# EAGLE design motoko_azure_dragon (EAGLE 9.6.0)
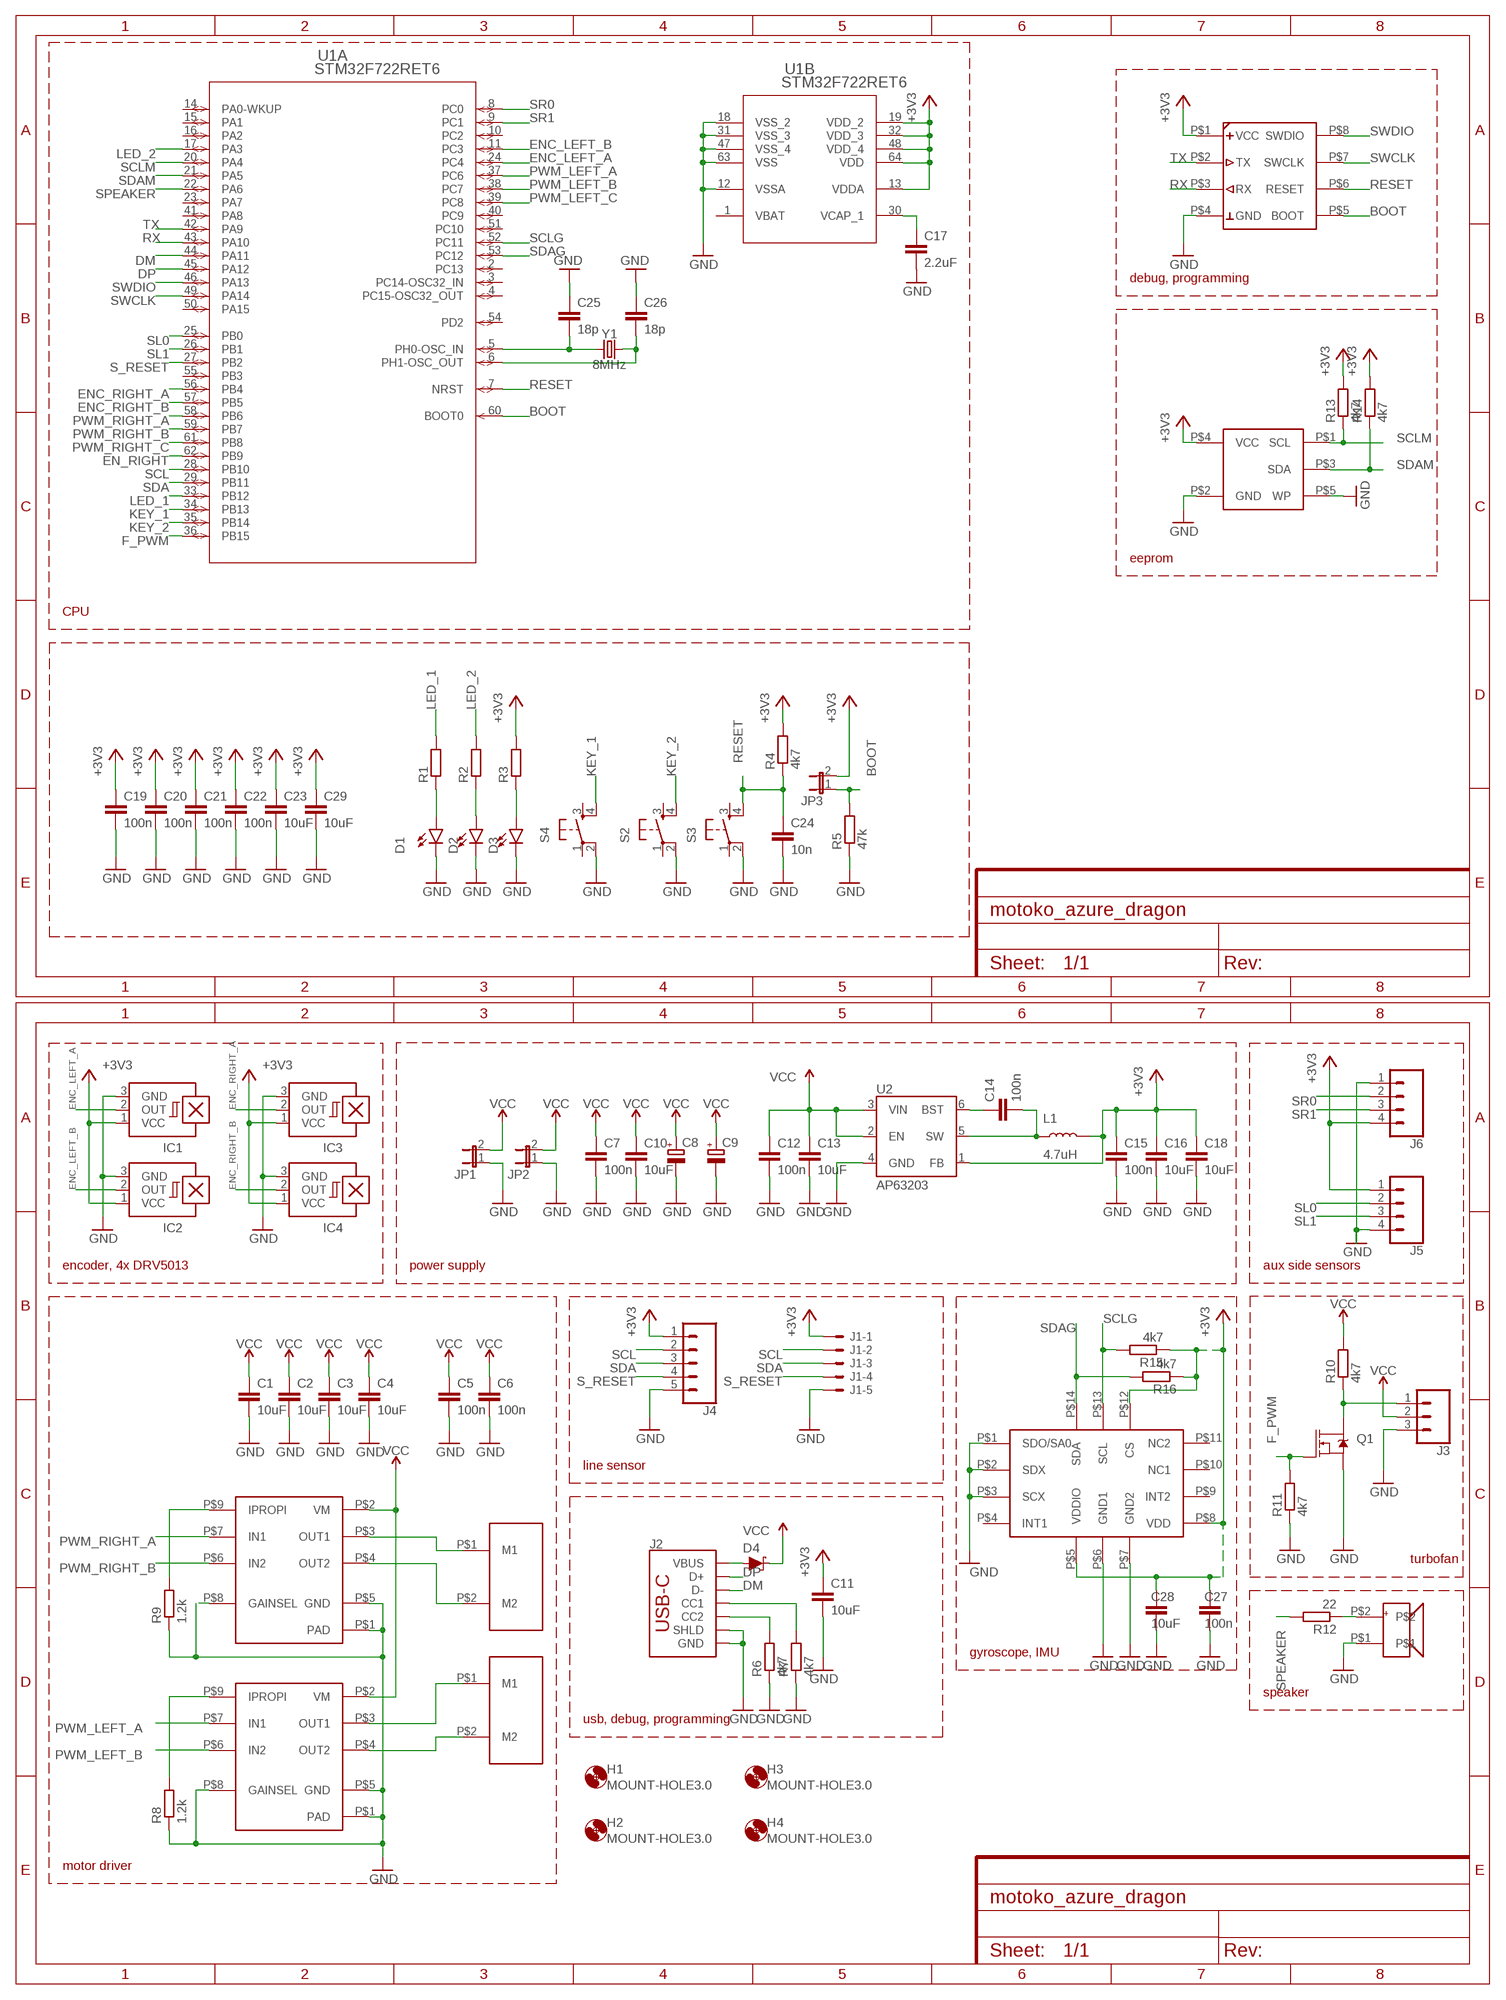
[diagram p0: schematic, sheet 1]

## Parts
C1  10uF  C-EUC0805  [C0805]
C2  10uF  C-EUC0805  [C0805]
C3  10uF  C-EUC0805  [C0805]
C4  10uF  C-EUC0805  [C0805]
C5  100n  C-EUC0805  [C0805]
C6  100n  C-EUC0805  [C0805]
C7  100n  C-EUC0805  [C0805]
C8  CPOL-EUB/3528-21W  [B/3528-21W]
C9  CPOL-EUB/3528-21W  [B/3528-21W]
C10  10uF  C-EUC0805  [C0805]
C11  10uF  C-EUC0805  [C0805]
C12  100n  C-EUC0805  [C0805]
C13  10uF  C-EUC0805  [C0805]
C14  100n  C-EUC0805  [C0805]
C15  100n  C-EUC0805  [C0805]
C16  10uF  C-EUC0805  [C0805]
C17  2.2uF  C-EUC0805  [C0805]
C18  10uF  C-EUC0805  [C0805]
C19  100n  C-EUC0805  [C0805]
C20  100n  C-EUC0805  [C0805]
C21  100n  C-EUC0805  [C0805]
C22  100n  C-EUC0805  [C0805]
C23  10uF  C-EUC0805  [C0805]
C24  10n  C-EUC0805  [C0805]
C25  18p  C-EUC0805  [C0805]
C26  18p  C-EUC0805  [C0805]
C27  100n  C-EUC0805  [C0805]
C28  10uF  C-EUC0805  [C0805]
C29  10uF  C-EUC0805  [C0805]
D1  LED1206  [LED-1206]
D2  LED1206  [LED-1206]
D3  LED1206  [LED-1206]
D4  3A/10V/280mV  DIODE-SCHOTTKY-BAT60A  [SOD-323]
H1  MOUNT-HOLE3.0  [3,0]
H2  MOUNT-HOLE3.0  [3,0]
H3  MOUNT-HOLE3.0  [3,0]
H4  MOUNT-HOLE3.0  [3,0]
IC1  A1202LH  [SOT23-W]
IC2  A1202LH  [SOT23-W]
IC3  A1202LH  [SOT23-W]
IC4  A1202LH  [SOT23-W]
J1  XF2L-0535-1  [XF2L-0535-1]
J2  USB_C_2-LAYER_PADS  [USB-C-16P-2LAYER-PADS]
J3  CONN_03LONGPADS  [1X03_LONGPADS]
J4  CONN_051.27MM  [1X05_1.27MM]
J5  1X04_SMD_STRAIGHT_COMBO  CONN_04SMD_STRAIGHT_COMBO  [1X04_SMD_VERTICAL_COMBO]
J6  1X04_SMD_STRAIGHT_COMBO  CONN_04SMD_STRAIGHT_COMBO  [1X04_SMD_VERTICAL_COMBO]
JP1  JP1E  [JP1]
JP2  JP1E  [JP1]
JP3  JP1E  [JP1]
L1  4.7uH  INDUCTOR-CR54-3.3UH  [CR54]
Q1  5.8A/30V/35mΩ  MOSFET-NCH-AO3404A  [SOT23-3]
R1  R-EU_M0805  [M0805]
R2  R-EU_M0805  [M0805]
R3  R-EU_M0805  [M0805]
R4  4k7  R-EU_M0805  [M0805]
R5  47k  R-EU_M0805  [M0805]
R6  4k7  R-EU_M0805  [M0805]
R7  4k7  R-EU_M0805  [M0805]
R8  1.2k  R-EU_M0805  [M0805]
R9  1.2k  R-EU_M0805  [M0805]
R10  4k7  R-EU_M0805  [M0805]
R11  4k7  R-EU_M0805  [M0805]
R12  22  R-EU_M0805  [M0805]
R13  4k7  R-EU_M0805  [M0805]
R14  4k7  R-EU_M0805  [M0805]
R15  4k7  R-EU_M0805  [M0805]
R16  4k7  R-EU_M0805  [M0805]
S2  TAC_SWITCHSMD  [TACTILE-SWITCH-SMD]
S3  TAC_SWITCHSMD  [TACTILE-SWITCH-SMD]
S4  TAC_SWITCHSMD  [TACTILE-SWITCH-SMD]
U1  STM32F722RET6  [LQFP64-10X10MM]
U2  AP63203  [SOT23-6]
U$2  POLOLU_MICRO_METAL_GEAR_MOTOR  [POLOLU_MICRO_METAL_GEAR_MOTOR]
U$3  POLOLU_MICRO_METAL_GEAR_MOTOR  [POLOLU_MICRO_METAL_GEAR_MOTOR]
U$4  DRV8213  [DSG8]
U$5  DRV8213  [DSG8]
U$6  24LC24_SOT23  [SOT23]
U$7  DEBUG_CON  [HEADER_4X2_1.27]
U$8  LSM6DSM  [LGA14L]
U$9  SPEAKER_SMD_SMT0440  [SPEAKER_SMD_SMT0440]
Y1  8MHz  CRYSTALSMD-3.2X2.5  [CRYSTAL-SMD-3.2X2.5MM]

## Nets
+3V3: C11.1 C15.1 C16.1 C18.1 C19.1 C20.1 C21.1 C22.1 C23.1 C27.1 C28.1 C29.1 IC1.1(VCC) IC2.1(VCC) IC3.1(VCC) IC4.1(VCC) J1.1 J4.1 J5.1 J6.4 JP3.2 L1.P$2 R3.2 R4.2 R13.2 R14.2 R15.1 R16.1 U1.13(B:VDDA) U1.19(B:VDD_2) U1.32(B:VDD_3) U1.48(B:VDD_4) U1.64(B:VDD) U2.1(FB) U$6.P$4(VCC) U$7.P$1(VCC) U$8.P$5(VDDIO) U$8.P$8(VDD) U$8.P$12(CS)
BOOT: JP3.1 R5.2 U1.60(A:BOOT0) U$7.P$5(BOOT)
DM: J2.A7(D-) J2.B7(D-) U1.44(A:PA11)
DP: J2.A6(D+) J2.B6(D+) U1.45(A:PA12)
EN_RIGHT: U1.62(A:PB9)
ENC_LEFT_A: IC1.2(OUT) U1.24(A:PC4)
ENC_LEFT_B: IC2.2(OUT) U1.11(A:PC3)
ENC_RIGHT_A: IC3.2(OUT) U1.56(A:PB4)
ENC_RIGHT_B: IC4.2(OUT) U1.57(A:PB5)
F_PWM: Q1.1(G) R11.2 U1.36(A:PB15)
GND: C1.2 C2.2 C3.2 C4.2 C5.2 C6.2 C7.2 C8.- C9.- C10.2 C11.2 C12.2 C13.2 C15.2 C16.2 C17.2 C18.2 C19.2 C20.2 C21.2 C22.2 C23.2 C24.2 C25.1 C26.1 C27.2 C28.2 C29.2 D1.C D2.C D3.C IC1.3(GND) IC2.3(GND) IC3.3(GND) IC4.3(GND) J1.5 J2.GND J2.GND2(GND) J2.SHLD1(SHLD) J2.SHLD2(SHLD) J2.SHLD3(SHLD) J2.SHLD4(SHLD) J3.3 J4.5 J5.4 J6.1 JP1.1 JP2.1 Q1.2(S) R5.1 R6.1 R7.1 R8.1 R9.1 R11.1 S2.2 S3.2 S4.2 U1.12(B:VSSA) U1.18(B:VSS_2) U1.31(B:VSS_3) U1.47(B:VSS_4) U1.63(B:VSS) U2.4(GND) U$4.P$1(PAD) U$4.P$5(GND) U$4.P$8(GAINSEL) U$5.P$1(PAD) U$5.P$5(GND) U$5.P$8(GAINSEL) U$6.P$2(GND) U$6.P$5(WP) U$7.P$4(GND) U$8.P$1(SDO/SA0) U$8.P$2(SDX) U$8.P$3(SCX) U$8.P$6(GND1) U$8.P$7(GND2) U$9.P$1
KEY_1: S4.4 U1.34(A:PB13)
KEY_2: S2.4 U1.35(A:PB14)
LED_1: R1.2 U1.33(A:PB12)
LED_2: R2.2 U1.17(A:PA3)
N$1: U$3.P$2(M2) U$5.P$4(OUT2)
N$2: U$3.P$1(M1) U$5.P$3(OUT1)
N$3: U$2.P$2(M2) U$4.P$4(OUT2)
N$4: U$2.P$1(M1) U$4.P$3(OUT1)
N$5: C14.2 L1.P$1 U2.5(SW)
N$6: C14.1 U2.6(BST)
N$7: D1.A R1.1
N$8: D2.A R2.1
N$9: D3.A R3.1
N$10: J2.B5(CC2) R6.2
N$11: J2.A5(CC1) R7.2
N$12: C17.1 U1.30(B:VCAP_1)
N$13: C25.2 U1.5(A:PH0-OSC_IN) Y1.1
N$14: C26.2 U1.6(A:PH1-OSC_OUT) Y1.3
N$15: R8.2 U$5.P$9(IPROPI)
N$16: R9.2 U$4.P$9(IPROPI)
N$17: D4.A J2.VBUS1(VBUS) J2.VBUS2(VBUS)
N$18: J3.1 Q1.3(D) R10.1
N$19: R12.1 U$9.P$2
PWM_LEFT_A: U1.37(A:PC6) U$5.P$7(IN1)
PWM_LEFT_B: U1.38(A:PC7) U$5.P$6(IN2)
PWM_LEFT_C: U1.39(A:PC8)
PWM_RIGHT_A: U1.58(A:PB6) U$4.P$7(IN1)
PWM_RIGHT_B: U1.59(A:PB7) U$4.P$6(IN2)
PWM_RIGHT_C: U1.61(A:PB8)
RESET: C24.1 R4.1 S3.4 U1.7(A:NRST) U$7.P$6(RESET)
RX: U1.43(A:PA10) U$7.P$3(RX)
S_RESET: J1.4 J4.4 U1.27(A:PB2)
SCL: J1.2 J4.2 U1.28(A:PB10)
SCLG: R15.2 U1.52(A:PC11) U$8.P$13(SCL)
SCLM: R13.1 U1.20(A:PA4) U$6.P$1(SCL)
SDA: J1.3 J4.3 U1.29(A:PB11)
SDAG: R16.2 U1.53(A:PC12) U$8.P$14(SDA)
SDAM: R14.1 U1.21(A:PA5) U$6.P$3(SDA)
SL0: J5.2 U1.25(A:PB0)
SL1: J5.3 U1.26(A:PB1)
SPEAKER: R12.2 U1.22(A:PA6)
SR0: J6.2 U1.8(A:PC0)
SR1: J6.3 U1.9(A:PC1)
SWCLK: U1.49(A:PA14) U$7.P$7(SWCLK)
SWDIO: U1.46(A:PA13) U$7.P$8(SWDIO)
TX: U1.42(A:PA9) U$7.P$2(TX)
VCC: C1.1 C2.1 C3.1 C4.1 C5.1 C6.1 C7.1 C8.+ C9.+ C10.1 C12.1 C13.1 D4.C J3.2 JP1.2 JP2.2 R10.2 U2.2(EN) U2.3(VIN) U$4.P$2(VM) U$5.P$2(VM)
Unconnected: S2.1 S2.3 S3.1 S3.3 S4.1 S4.3 U1.2(A:PC13) U1.3(A:PC14-OSC32_IN) U1.4(A:PC15-OSC32_OUT) U1.10(A:PC2) U1.14(A:PA0-WKUP) U1.15(A:PA1) U1.16(A:PA2) U1.23(A:PA7) U1.40(A:PC9) U1.41(A:PA8) U1.50(A:PA15) U1.51(A:PC10) U1.54(A:PD2) U1.55(A:PB3) U$8.P$4(INT1) U$8.P$9(INT2) U$8.P$10(NC1) U$8.P$11(NC2)

## Notes on the sheet
- debug, programming
- eeprom
- CPU
- encoder, 4x DRV5013 | power supply | aux side sensors
- line sensor
- turbofan
- gyroscope, IMU
- speaker
- usb, debug, programming
- motor driver

## Power pins joined to a net without a drawn wire
VBAT: U1.1(B:VBAT)

## Library data of the parts
C1-C7 C10-C29 = rcl:C-EU: CAPACITOR, European symbol; SPICEPREFIX: C
C8 C9 = rcl:CPOL-EU: POLARIZED CAPACITOR, European symbol; SPICEPREFIX: C
D1-D3 = SparkFun-LED:LED: LED (Generic) Standard schematic elements and footprints for 5mm, 3mm, 1206, and 0603 sized LEDs. Generic LEDs with no color specified.
D4 = SparkFun-DiscreteSemi:DIODE-SCHOTTKY: Schottky diode A Schottky diode is a semiconductor diode which has a low forward voltage drop and a very fast switching action.; PROD_ID: DIO-14072
H1-H4 = holes:MOUNT-HOLE: MOUNTING HOLE with drill center marker
IC1-IC4 = allegro:A12*?: Hall-effect bipolar switch Source: http://www.allegromicro.com/en/Products/Part_Numbers/1202/1202.pdf; OC_FARNELL: unknown; OC_NEWARK: unknown
J1 = con-omron:XF2*-05?: OMRON FPC Connector Source : http://www.omron.com/ecb/products/pdf/fpc.pdf; MPN: XF2L-0535-1A; OC_FARNELL: unknown; OC_NEWARK: 37M0863
J2 = SparkFun-Connectors:USB_C: USB Type C 16Pin Connector Super Speed pins not available on the 16-pin purely SMD connector so this part is best for USB 2.0 implementations. D1 and D2 are tied together enabling D+/- no matter which way the cable is plugged into the connector. The two channel configuration pins (CC1/2) are exposed. These are normally connected to ground via 5.1k resistors but can be reconfigured for high current/high power applications.; PROD_ID: CONN-14122
J3 = SparkFun-Connectors:CONN_03: Multi connection point. Often used as Generic Header-pin footprint for 0.1 inch spaced/style header connections On any of the 0.1 inch spaced packages, you can populate with these: Break Away Headers - Straight <https://www.sparkfun.com/products/116> (PRT-00116) Break Away Male Headers - Right Angle <https://www.sparkfun.com/products/553> (PRT-00553) Female Headers <https://www.sparkfun.com/products/115> (PRT-00115) Break Away Headers - Machine Pin <https://www.sparkfun.com/products/117> (PRT-00117) Break Away Female Headers - Swiss Machine Pin <https://www.sparkfun.com/products/743> (PRT-00743) Stackable Header - 3 Pin (Female, 0.1") <https://www.sparkfun.com/products/13875> (PRT-13875) For SCREWTERMINALS and SPRING TERMINALS visit here: Screw Terimnals on SparkFun.com <https://www.sparkfun.com/search/results?term=Screw+Terminals> (5mm/3.5mm/2.54mm spacing) This device is also useful as a general connection point to wire up your design to another part of your project. Our various solder wires solder well into these plated through hole pads. Hook-Up Wire - Assortment (Stranded, 22 AWG) <https://www.sparkfun.com/products/11375> (PRT-11375) Hook-Up Wire - Assortment (Solid Core, 22 AWG) <https://www.sparkfun.com/products/11367> (PRT-11367) View the entire wire category on our website here <https://www.sparkfun.com/categories/141> Special notes: Molex polarized connector foot print use with SKU : PRT-08232 with associated crimp pins and housings.
J4 = SparkFun-Connectors:CONN_05: Multi connection point. Often used as Generic Header-pin footprint for 0.1 inch spaced/style header connections On any of the 0.1 inch spaced packages, you can populate with these: Break Away Headers - Straight <https://www.sparkfun.com/products/116> (PRT-00116) Break Away Male Headers - Right Angle <https://www.sparkfun.com/products/553> (PRT-00553) Female Headers <https://www.sparkfun.com/products/115> (PRT-00115) Break Away Headers - Machine Pin <https://www.sparkfun.com/products/117> (PRT-00117) Break Away Female Headers - Swiss Machine Pin <https://www.sparkfun.com/products/743> (PRT-00743) For SCREWTERMINALS and SPRING TERMINALS visit here: Screw Terimnals on SparkFun.com <https://www.sparkfun.com/search/results?term=Screw+Terminals> (5mm/3.5mm/2.54mm spacing) This device is also useful as a general connection point to wire up your design to another part of your project. Our various solder wires solder well into these plated through hole pads. Hook-Up Wire - Assortment (Stranded, 22 AWG) <https://www.sparkfun.com/products/11375> (PRT-11375) Hook-Up Wire - Assortment (Solid Core, 22 AWG) <https://www.sparkfun.com/products/11367> (PRT-11367) View the entire wire category on our website here <https://www.sparkfun.com/categories/141> Special notes: Molex polarized connector foot print use with SKU : PRT-08231 with associated crimp pins and housings. 1MM SMD Version SKU: PRT-10208
J5 J6 = SparkFun-Connectors:CONN_04: Multi connection point. Often used as Generic Header-pin footprint for 0.1 inch spaced/style header connections On any of the 0.1 inch spaced packages, you can populate with these: Break Away Headers - Straight <https://www.sparkfun.com/products/116> (PRT-00116) Break Away Male Headers - Right Angle <https://www.sparkfun.com/products/553> (PRT-00553) Female Headers <https://www.sparkfun.com/products/115> (PRT-00115) Break Away Headers - Machine Pin <https://www.sparkfun.com/products/117> (PRT-00117) Break Away Female Headers - Swiss Machine Pin <https://www.sparkfun.com/products/743> (PRT-00743) For SCREWTERMINALS and SPRING TERMINALS visit here: Screw Terimnals on SparkFun.com <https://www.sparkfun.com/search/results?term=Screw+Terminals> (5mm/3.5mm/2.54mm spacing) This device is also useful as a general connection point to wire up your design to another part of your project. Our various solder wires solder well into these plated through hole pads. Hook-Up Wire - Assortment (Stranded, 22 AWG) <https://www.sparkfun.com/products/11375> (PRT-11375) Hook-Up Wire - Assortment (Solid Core, 22 AWG) <https://www.sparkfun.com/products/11367> (PRT-11367) View the entire wire category on our website here <https://www.sparkfun.com/categories/141> Special notes: Molex polarized connector foot print use with SKU : PRT-08231 with associated crimp pins and housings. 1MM SMD Version SKU: PRT-10208; PROD_ID: CONN-08511
JP1-JP3 = jumper:JP1E: JUMPER
L1 = SparkFun-Coils:INDUCTOR: Inductors Resist changes in electrical current. Basically a coil of wire. SparkFun Products: SparkFun Load Cell Amplifier - HX711 <https://www.sparkfun.com/products/13879> IOIO-OTG - V2.2 <https://www.sparkfun.com/products/13613>; PROD_ID: NDUC-11157; VALUE: 3.3µH/±30%/3.4A
Q1 = SparkFun-DiscreteSemi:MOSFET-NCH: N-channel MOSFETs Voltage controlled devices that allow control of high current outputs. SparkFun Products: SparkFun OpenScale <https://www.sparkfun.com/products/13261> SparkFun Digital Sandbox <https://www.sparkfun.com/products/12651> SparkFun Monster Moto Shield <https://www.sparkfun.com/products/10182> SparkFun MOSFET Power Controller <https://www.sparkfun.com/products/11214>; PROD_ID: TRANS-12988
R1-R16 = rcl:R-EU_: RESISTOR, European symbol; SPICEPREFIX: R
S2-S4 = SparkFun-Retired:TAC_SWITCH: Momentary Switch Button commonly used for reset or general input. Spark Fun Electronics SKU : COM-00097 SMT- SWCH-08247; PROD_ID: SWCH-08247
U1 = my_library:STM32F722RET6; COPYRIGHT: Copyright (C) 2024 Ultra Librarian. All rights reserved.; MANUFACTURER_PART_NUMBER: STM32F722RET6; MFR_NAME: STMicroelectronics
U2 = SparkFun-IC-Power:AP63203: Diodes Inc. AP63203 3.8V-32V input 3.3V Buck The AP63200/AP63201/AP63203/AP63205 is a 2A, synchronous buck converter with a wide input voltage range of 3.8V to 32V and fully integrates a 125mΩ high-side power MOSFET and a 68mΩ lowside power MOSFET to provide high-efficiency step-down DC/DC conversion; PROD_ID: VREG-15244
U$2 U$3 = my_library:POLOLU_MICRO_METAL_GEAR_MOTOR
U$4 U$5 = my_library:DRV8213
U$6 = my_library:24LC24_SOT23
U$7 = my_library:DEBUG_CON
U$8 = my_library:LSM6DSM
U$9 = my_library:SPEAKER_SMD_SMT0440
Y1 = SparkFun-Clocks:CRYSTAL: Crystals (Generic) These are passive quartz crystals, which can be used as a clock source for a microcontroller. Crystal's are two-terminal devices. They require external "load" capacitors to generate an oscillating signal.

## Board
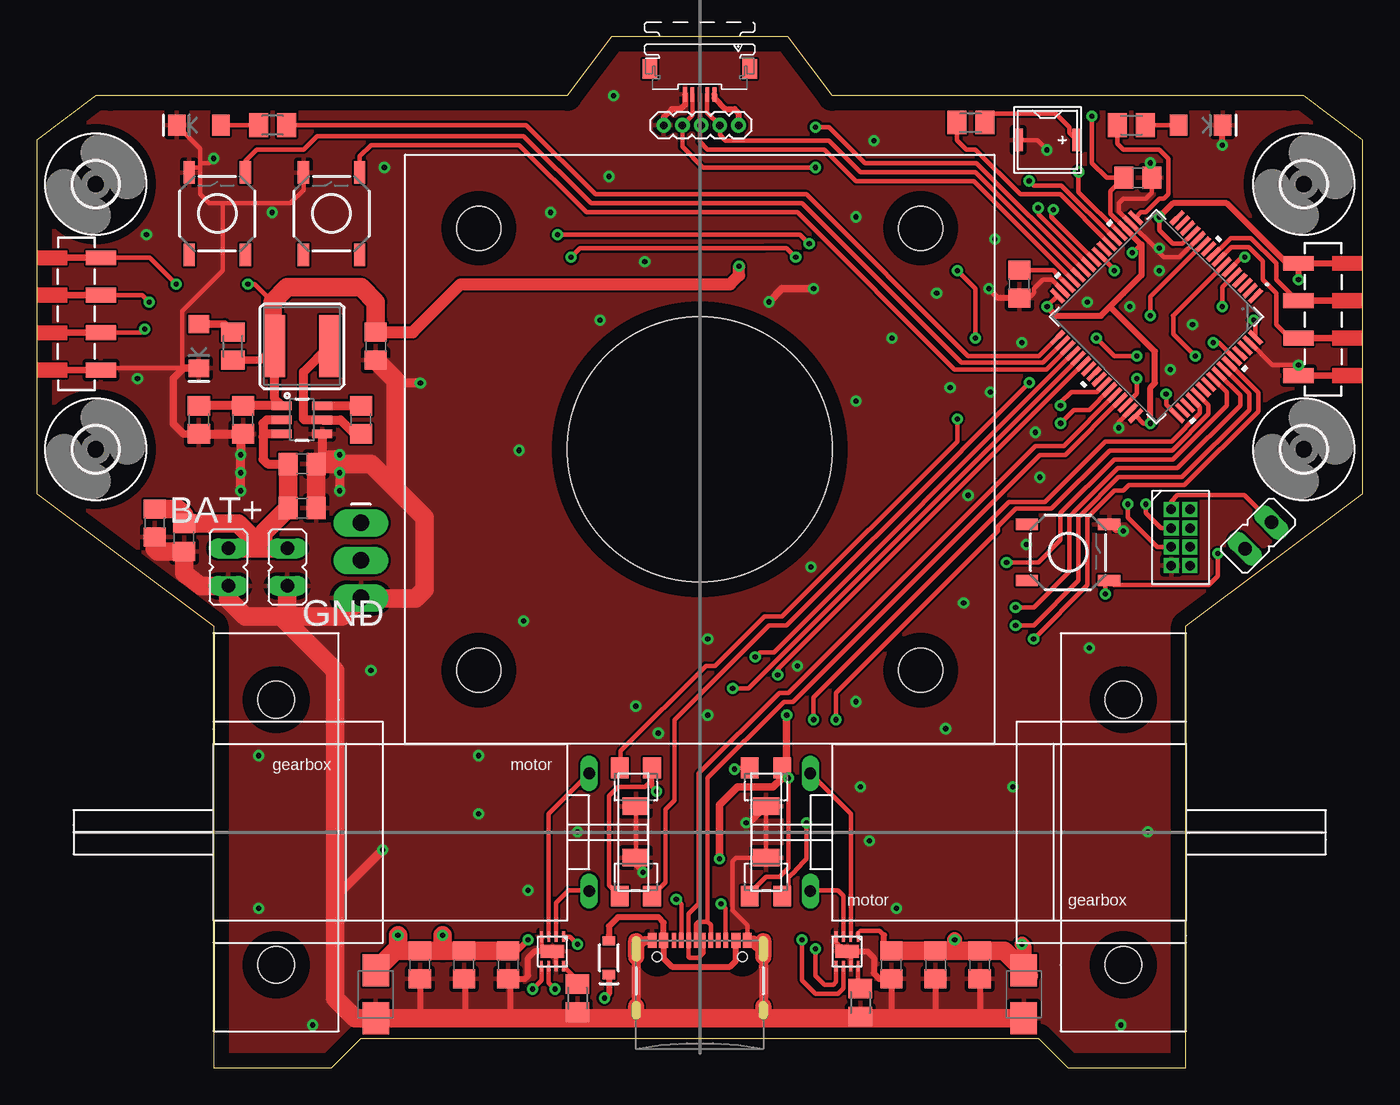
[diagram p1: board, top side]
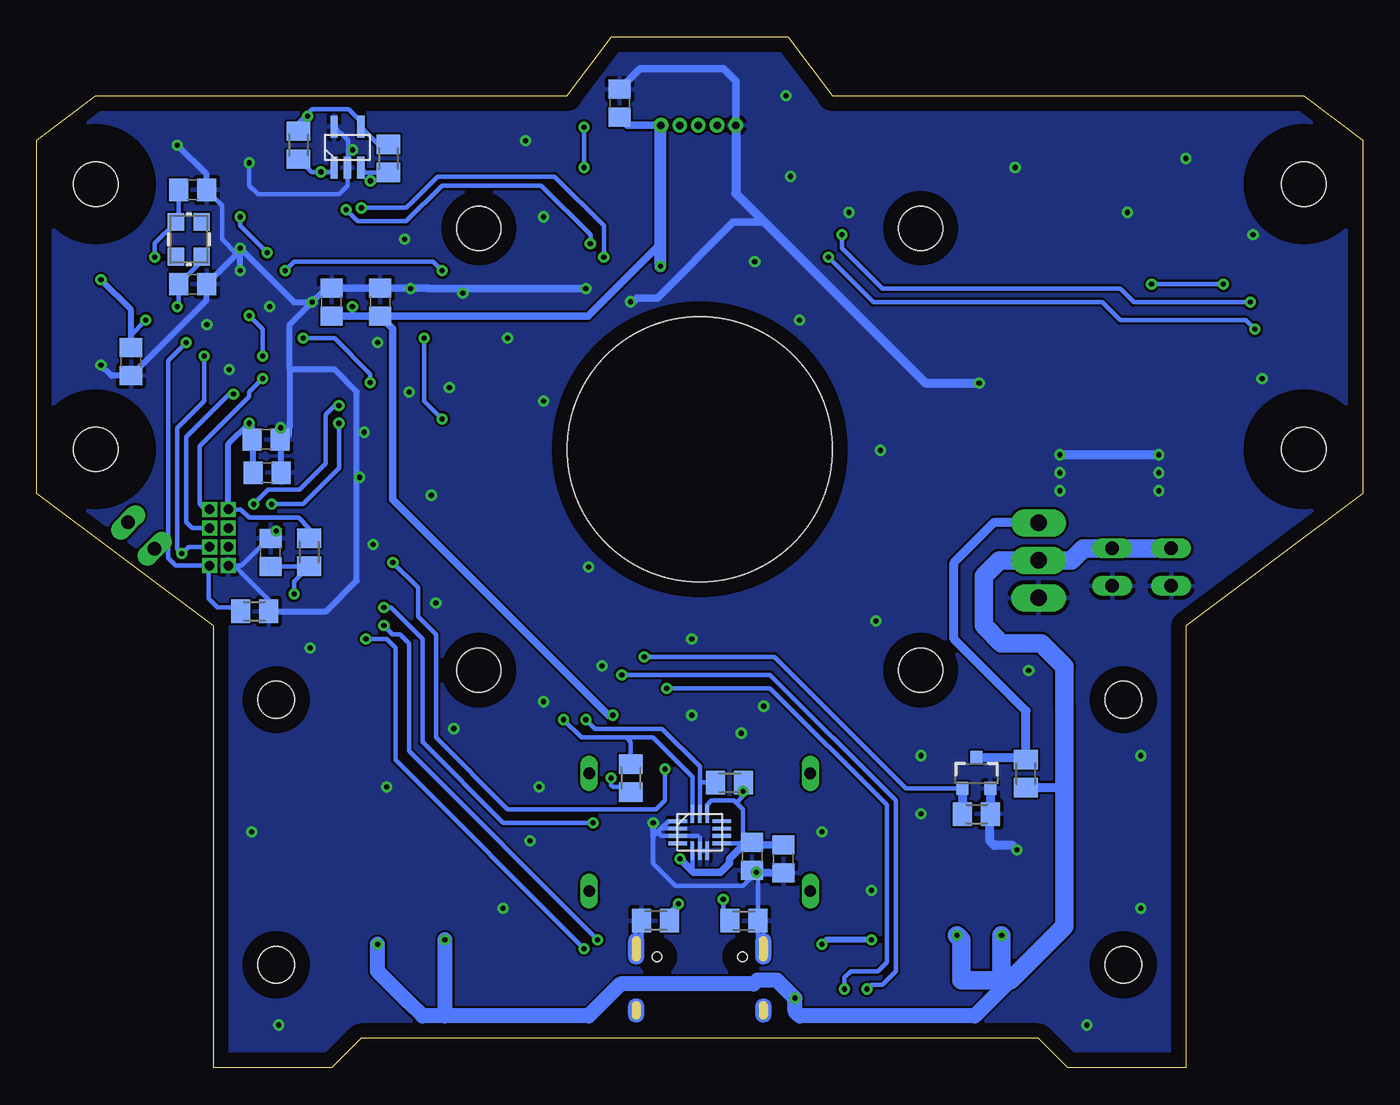
[diagram p2: board, bottom side, seen from below]

Size 90 x 70 mm. Coordinates in mm from the lower left corner, seen from the top.
Outline: 12,0 20,0 22,2 68,2 70,0 78,0 78,30 90,39 90,63 86,66 85,66 54,66 51,70 39,70 36,66 5,66 4,66 0,63 0,39 12,30 12,0
Copper layers (1*16): Top 0.035mm / dielectric 1.5mm / Bottom 0.035mm
Design rules "default *": minimum track width 6mil, minimum drill 0.35mm, track to track 6mil, track to pad 6mil, pad to pad 6mil, via to via 6mil, smd to smd 6mil, copper to edge 40mil, drill to drill 6mil, minimum pad ring 5mil, minimum via ring 8mil, stop-mask expansion 4mil, vias tented up to drill 0mil, thermal gap 10mil

### Footprints (pad centres in the part's own frame; a part is rotated, then mirrored left to right if it is on the bottom)
C0805 = smd 1.3 x 1.5: 1 -0.95,0; 2 0.95,0
B/3528-21W = smd 2.15 x 1.8: + 1.625,0; - -1.625,0
LED-1206 = smd 1.2 x 1.4: A -1.5,0; C 1.5,0
SOD-323 = smd 0.63 x 0.83: A 1.15,0; C -1.15,0
3,0 = hole 3: 0,0
SOT23-W = smd 1.2 x 1.4: 1 -1.1,-1.3; 2 1.1,-1.3 | smd 1.8 x 1.2: 3 0,1.3
XF2L-0535-1 = smd 1 x 0.25: 1 1.905,1; 2 1.905,0.5; 3 1.905,0; 4 1.905,-0.5; 5 1.905,-1 | smd 1.34 x 1: M1 0.18,3.388; M2 0.18,-3.388
USB-C-16P-2LAYER-PADS = smd 0.3 x 1: A5 -1.25,-0.34; A6 -0.25,-0.34; A7 0.25,-0.34; A8 1.25,-0.34; B5 1.75,-0.34; B6 0.75,-0.34; B7 -0.75,-0.34; B8 -1.75,-0.34 | smd 0.6 x 1: GND -3.225,-0.34; GND2 3.225,-0.34; VBUS1 -2.45,-0.34; VBUS2 2.45,-0.34 | drill 0.4 pad 0.6 long: SHLD1 -4.318,-0.915; SHLD2 4.318,-0.915; SHLD3 -4.318,-5.095; SHLD4 4.318,-5.095 | hole 0.65: -2.89,-1.445; 2.89,-1.445
1X03_LONGPADS = drill 1.118 pad 1.88 long: 1 0,0; 2 2.54,0; 3 5.08,0
1X05_1.27MM = drill 0.508 pad 1: 1 0,0; 2 1.27,0; 3 2.54,0; 4 3.81,0; 5 5.08,0
1X04_SMD_VERTICAL_COMBO = smd 1 x 2: 1 0,1.65; 2 2.54,1.65; 3 5.08,1.65; 4 7.62,1.652
JP1 = drill 0.914 long: 1 0,-1.27; 2 0,1.27
CR54 = smd 4.2 x 1.4: P$1 0,1.85; P$2 0,-1.85
SOT23-3 = smd 0.8 x 0.9: 1 -0.95,-1; 2 0.95,-1; 3 0,1.1
M0805 = smd 1.3 x 1.6: 1 -0.95,0; 2 0.95,0
TACTILE-SWITCH-SMD = smd 1.524 x 0.762: 1 -2.794,1.905; 2 2.794,1.905; 3 -2.794,-1.905; 4 2.794,-1.905
LQFP64-10X10MM = smd 1.194 x 0.305: 1 -5.75,3.75; 2 -5.75,3.25; 3 -5.75,2.75; 4 -5.75,2.25; 5 -5.75,1.75; 6 -5.75,1.25; 7 -5.75,0.75; 8 -5.75,0.25; 9 -5.75,-0.25; 10 -5.75,-0.75; 11 -5.75,-1.25; 12 -5.75,-1.75; 13 -5.75,-2.25; 14 -5.75,-2.75; 15 -5.75,-3.25; 16 -5.75,-3.75; 33 5.75,-3.75; 34 5.75,-3.25; 35 5.75,-2.75; 36 5.75,-2.25; 37 5.75,-1.75; 38 5.75,-1.25; 39 5.75,-0.75; 40 5.75,-0.25; 41 5.75,0.25; 42 5.75,0.75; 43 5.75,1.25; 44 5.75,1.75; 45 5.75,2.25; 46 5.75,2.75; 47 5.75,3.25; 48 5.75,3.75 | smd 0.305 x 1.194: 17 -3.75,-5.75; 18 -3.25,-5.75; 19 -2.75,-5.75; 20 -2.25,-5.75; 21 -1.75,-5.75; 22 -1.25,-5.75; 23 -0.75,-5.75; 24 -0.25,-5.75; 25 0.25,-5.75; 26 0.75,-5.75; 27 1.25,-5.75; 28 1.75,-5.75; 29 2.25,-5.75; 30 2.75,-5.75; 31 3.25,-5.75; 32 3.75,-5.75; 49 3.75,5.75; 50 3.25,5.75; 51 2.75,5.75; 52 2.25,5.75; 53 1.75,5.75; 54 1.25,5.75; 55 0.75,5.75; 56 0.25,5.75; 57 -0.25,5.75; 58 -0.75,5.75; 59 -1.25,5.75; 60 -1.75,5.75; 61 -2.25,5.75; 62 -2.75,5.75; 63 -3.25,5.75; 64 -3.75,5.75
SOT23-6 = smd 0.55 x 1.35: 1 -0.95,-1.375; 2 0,-1.375; 3 0.95,-1.375; 4 0.95,1.375; 5 0,1.375; 6 -0.95,1.375
DUCTED_FAN_40MM = hole 18: 0,0 | hole 3: -15,15; 15,15; -15,-15; 15,-15
POLOLU_MICRO_METAL_GEAR_MOTOR = drill 0.8 long: P$1 -1.5,4; P$2 -1.5,-4 | hole 2.5: 19.75,9; 19.75,-9
DSG8 = smd 0.9 x 1.6: P$1 0,0 | smd 0.7 x 0.18: P$2 -1,0.75; P$3 -1,0.25; P$4 -1,-0.25; P$5 -1,-0.75; P$6 1,-0.75; P$7 1,-0.25; P$8 1,0.25; P$9 1,0.75
SOT23 = smd 0.5 x 1.5: P$1 -0.9,-0.5; P$2 0,-0.5; P$3 0.9,-0.5; P$4 0.9,2.3; P$5 -0.9,2.3
HEADER_4X2_1.27 = drill 0.65 pad 1.016 square: P$1 0,0; P$2 0,-1.27; P$3 0,-2.54; P$4 0,-3.81; P$5 1.27,-3.81; P$6 1.27,-2.54; P$7 1.27,-1.27; P$8 1.27,0
LGA14L = smd 1.25 x 0.25: P$1 -1.5,0.75; P$2 -1.5,0.25; P$3 -1.5,-0.25; P$4 -1.5,-0.75; P$8 1.5,-0.75; P$9 1.5,-0.25; P$10 1.5,0.25; P$11 1.5,0.75 | smd 0.25 x 1.25: P$5 -0.5,-1.25; P$6 0,-1.25; P$7 0.5,-1.25; P$12 0.5,1.25; P$13 0,1.25; P$14 -0.5,1.25
SPEAKER_SMD_SMT0440 = smd 0.635 x 1.5: P$1 -2,0; P$2 2,0
CRYSTAL-SMD-3.2X2.5MM = smd 1.2 x 1.1: 1 -1.175,-0.875; 2 1.175,-0.875; 3 1.175,0.875; 4 -1.175,0.875

### Placement (x,y rotation side)
C1  29,7 270 top
C2  26,7 270 top
C3  61,7 270 top
C4  64,7 270 top
C5  32,7 270 top
C6  58,7 270 top
C7  8,37 270 top
C8  23,5 90 top
C9  67,5 90 top
C10  10,36 270 top
C11  50.44,65.49 90 bottom
C12  18,41 0 top
C13  18,38 0 top
C14  22,44 270 top
C15  14,44 270 top
C16  11,44 270 top
C17  66.7,53.22 270 top
C18  23,49 270 top
C19  66.7,52 90 bottom
C20  83.61,47.95 270 bottom
C21  74.74,60.43 0 top
C22  74.44,42.66 0 bottom
C23  70,52 90 bottom
C24  74.13,35 90 bottom
C25  79.43,53.21 180 bottom
C26  79.43,59.61 180 bottom
C27  41.45,14.37 270 bottom
C28  39.32,14.19 270 bottom
C29  74.37,40.4 0 bottom
D1  11,64 180 top
D2  79,64 0 top
D3  11,49 270 top
D4  38.83,7.49 90 top
H1  86,60 0 top
H2  86,42 0 top
H3  4,42 0 top
H4  4,60 0 top
IC1  40.66,19.07 180 top
IC2  40.66,12.97 0 top
IC3  49.5,19.07 180 top
IC4  49.5,12.97 0 top
J1  45,68 270 top
J2  45,9 0 top
J3  22,37 270 top
J4  47.63,64 180 top
J5  2.7,55 270 top
J6  87.3,47 90 top
JP1  17,34 0 top
JP2  13,34 0 top
JP3  82.91,36.14 315 top
L1  18,49 270 top
Q1  26.21,19.98 0 bottom
R1  16,64 0 top
R2  74.3,64 180 top
R3  13.3,49 270 top
R4  71.51,35.01 90 bottom
R5  75.22,31 180 bottom
R6  48,10 0 bottom
R7  42,10 180 bottom
R8  36.7,4.74 90 top
R9  55.9,4.44 90 top
R10  22.86,19.98 270 bottom
R11  26.21,17.24 180 bottom
R12  63.4,64.18 180 top
R13  72.24,62.66 90 bottom
R14  66.14,61.74 90 bottom
R15  42.98,19.37 180 bottom
R16  49.68,19.68 90 bottom
S2  20,58 90 top
S3  70,35 0 top
S4  12.25,58 90 top
U1  76,51 225 top
U2  18,44 270 top
U$1  [DUCTED_FAN_40MM]  45,42 0 top
U$2  54,16 0 top
U$3  36,16 180 top
U$4  55,7.91 270 top
U$5  35,7.91 270 top
U$6  68.91,61.61 0 bottom
U$7  77,37.91 0 top
U$8  45,16 0 bottom
U$9  68.61,63 0 top
Y1  79.68,56.25 90 bottom

### Tracks (layer width: path | path; a pad name or v marks a point on that pad's centre or on a via)
+3V3  (via drill 0.35)
  Top 0.305: IC2.1 38.83,12.4 38.83,18.46 39.44,19.07 41.27,19.07 41.76,19.56 IC1.1 41.76,19.07 v42.06,18.76 | IC4.1 48.4,11.87 49.5,12.97 50.41,12.97 51.02,13.58 v51.02,19.68 51.02,19.95 IC3.1 50.6,19.99 | J5.1 7.66,55 v9.45,53.21 | v14.33,53.21 14.79,53.21 16,52 | U1.32 68.58,51.71 v68.58,51.68 | U1.19 72.88,58.01 72.88,59.52 C21.1 72.63,60.43 71.63,61.44 v71.63,64.61 | U1.13 77.77,55.95 77.11,55.95 76.2,56.86 v76.2,57.78 | v74.37,55.34 74.94,55.91 74.98,55.91 | U1.64 82.72,50.65 v82.6,50.77 | U$7.P$1 77,38.46 77.42,38.88 81.96,38.88 JP3.2 | U1.48 75.11,43.76 v75.59,43.76
  Top 0.406: J1.1 46,65.85 46.76,65.09 47.37,65.09 47.63,64.83 J4.1 | v68.58,51.68 69.19,51.07 72.24,51.07 72.85,51.68 | 72.85,51.68 73.46,52.29 | 73.46,52.29 73.76,52.6 | U1.19 74.98,55.91 74.98,53.82 73.46,52.29 | v76.2,57.78 77.11,58.69 80.77,58.69 84.73,54.73 85.54,54.73 J6.4 v85.65,53.51 | 72.85,51.68 75.89,48.63 75.89,46.5 75.59,46.2 v75.59,43.76
  Top 0.508: R3.2 15.2,48.05 L1.P$2 | v46.33,14.19 46.33,17.85 47.55,19.07 49.99,19.07 50.6,19.68 IC3.1 50.9,20.67 v50.9,23.95
  Top 0.61: L1.P$2 16.15,48 16.15,45.42 U2.1 C15.1 C16.1
  Top 0.813: C18.1 25.52,49.95 28.77,53.21 47.06,53.21 47.67,53.82 v47.67,54.43
  Top 1.27: C18.1 23,50.77 23,52 22,53 17,53 16,52 16,48.15 16.15,48
  Bottom 0.152: 41.76,15.32 42.15,15.32 42.22,15.25
  Bottom 0.305: v9.45,53.21 v14.33,53.21 | v68.58,51.68 68.58,51.05 | v76.2,57.78 76.2,57.17 v74.37,55.34 | v82.6,50.77 83.61,49.76 C20.1 | U$8.P$12 44.5,17.85 44.2,18.15 42.67,18.15 42.52,18 | U$8.P$8 42.22,15.25 42.06,15.41 42.06,17.55 42.37,17.85 42.52,18 | 42.52,18 42.06,18.46 v42.06,18.76 42.06,19.34 R15.1 | R14.2 66.8,62.69 U$6.P$4 68.01,64.27 68.84,65.09 71.32,65.09 72.24,64.18 R13.2 72.24,64 v71.63,64.61 | C27.1 41.76,15.32 | U$8.P$5 45.5,13.36 45.41,13.28 | U$7.P$1 76.15,37.91 75.59,37.36 72.24,37.36 71.51,36.63 R4.2 | R16.1 50.02,19.07 50.9,19.07 51.02,19.19 v51.02,19.68
  Bottom 0.406: C19.1 68.58,51.05 C23.1 | C20.1 83.61,51.47 v85.65,53.51 | U$7.P$1 77,42.35 v75.59,43.76 75.39,43.55 C22.1 75.32,42.6 C29.1
  Bottom 0.508: C11.1 49.9,64 J4.1 | C23.1 C19.1 | C19.1 52.57,51.05 47.67,55.95 | C19.1 65.84,50.19 65.84,38.58 51.21,23.95 v50.9,23.95 | C28.1 41.27,15.14 C27.1 41.84,15.32 42.98,14.19 42.98,13.89 43.59,13.28 45.41,13.28 v46.33,14.19
  Bottom 0.813: v47.67,54.43 47.67,55.95 47.67,63.96 J4.1
BOOT  (via drill 0.35)
  Top 0.305: U1.60 80.23,49.24 v79.86,49.24
  Bottom 0.305: R5.2 76.43,31.26 77.72,31.26 78.33,31.87 78.33,33.7 | 78.33,33.7 78.33,34.04 | v79.86,49.24 81.08,48.02 81.08,35.83 | 78.33,34.04 U$7.P$5 80.57,34.1 81.08,34.61 81.08,35.83 | 78.33,34.04 78.33,33.7 | JP3.1 81.41,35.83 81.08,35.83
DM
  Top 0.305: J2.A7 45.25,7.81 44.93,7.49 44.32,7.49 44.25,7.56 J2.B7 44.25,10.46 44.93,11.14 44.93,17.55 44.93,19.98 50.41,25.47 51.02,25.47 67.79,42.23 69.71,42.23 U1.44
DP
  Top 0.305: J2.A6 44.75,9.75 44.93,9.93 45.54,9.93 | J2.B6 45.75,9.71 45.54,9.93 | U1.45 69.81,41.62 69.31,41.62 | 69.31,41.62 69.01,41.62 | 69.31,41.62 68.09,41.62 51.33,24.86 50.72,24.86 45.54,19.68 45.54,17.55 45.54,9.93
ENC_LEFT_A  (via drill 0.35)
  Top 0.305: IC1.2 39.62,20.43 39.62,21.51 45.41,27.3 46.02,27.3 49.38,30.65 50.6,30.65 62.48,42.54 v62.48,44.06 | v62.48,54.12 63.7,52.9 v63.7,49.55 | U1.24 73.15,54.2 v73.15,54.12
  Bottom 0.305: v73.15,54.12 72.54,54.73 63.09,54.73 v62.48,54.12 | v63.7,49.55 63.7,45.28 v62.48,44.06
ENC_LEFT_B  (via drill 0.35)
  Top 0.305: IC2.2 42.67,12.58 42.67,17.55 43.28,18.15 43.28,23.64 49.68,30.04 50.9,30.04 62.79,41.93 62.79,41.94 v67.38,46.53 | v75.59,51.07 75.59,52.36 U1.11 | v74.68,48.33 73.15,48.33 v71.93,49.55
  Bottom 0.305: v75.59,51.07 74.68,50.16 v74.68,48.33 | v71.93,49.55 69.8,49.55 67.36,47.11 67.36,46.5 67.38,46.52 v67.38,46.53
ENC_RIGHT_A  (via drill 0.35)
  Top 0.305: IC3.2 47.45,20.37 v47.37,20.29 | U1.56 80.77,45.87 80.77,44.98 77.11,41.32 73.15,41.32 69.49,37.66 69.49,35.83 67.97,34.31 v65.84,34.31
  Bottom 0.305: v47.37,20.29 47.37,18.15 47.98,17.55 58.03,17.55 62.91,22.42 62.91,29.43 64.13,30.65 64.13,32.6 v65.84,34.31
ENC_RIGHT_B  (via drill 0.35)
  Top 0.305: IC4.2 51.02,12.1 51.02,12.94 51.48,13.39 51.48,13.43 52.24,14.19 v52.24,16.63 | U1.57 81.69,45.67 81.69,44.98 77.42,40.71 73.38,40.71 70.41,37.74 70.41,37.7 70.1,37.39 70.1,33.7 67.67,31.26 v66.45,31.26
  Bottom 0.305: v52.24,16.63 58.34,16.63 63.83,22.12 63.83,29.13 65.96,31.26 v66.45,31.26
F_PWM  (via drill 0.35)
  Top 0.305: U1.36 50.03,28.21 49.07,28.21 v48.77,27.91
  Bottom 0.305: Q1.1 31,18.98 39.93,27.91 v48.77,27.91
  Bottom 0.61: Q1.1 R11.2
GND  (via drill 0.35)
  Top 0.305: S2.2 18.09,59.6 17.19,58.69 13.23,58.69 12.62,58.69 | 12.62,58.69 11.71,58.69 11.1,59.3 11.1,60.52 11.1,61.13 | D1.C 11.1,62.41 11.1,61.44 | 11.1,61.44 11.1,61.13 | 9.88,47.41 9.88,51.38 12.62,54.12 12.62,58.69 | IC1.3 IC2.3 40.66,13.76 v41.15,13.28 | IC3.3 IC4.3 47.45,14.27 47.22,14.04 47.22,10.69 48.23,9.68 J2.GND2 | U$5.P$8 35.25,7.66 U$5.P$1 | U$5.P$5 34.26,8.9 34.26,7.91 | U$4.P$8 55.25,7.66 U$4.P$1 54.66,8.26 54.53,8.26 54.25,8.54 U$4.P$5 | J2.GND2 48.8,8.09 | 48.8,8.09 J2.SHLD2 48.8,8.09 | J2.GND2 48.8,8.09 | J5.4 4.47,47.5 9.96,47.5 | S4.2 10.68,61.13 11.1,61.13 | v12.01,61.74 11.71,61.44 11.1,61.44 | U1.31 68.89,53.51 68.28,53.51 67.67,52.9 67.67,52.6 67.34,52.27 C17.2 | 73.76,57.84 U1.18 | C21.2 75.39,60.43 | U1.18 75.95,55.65 v76.2,55.65 76.2,55.34 76.5,55.03 77.56,55.03 U1.12 | U1.63 83.88,47.72 v85.65,47.72 | S3.2 73.26,36.44 v73.76,36.44 | U1.18 73.46,58.14 73.46,58.69 73.76,59 75.29,59 75.69,59.4 C21.2 | U$9.P$1 67.93,63 68.58,62.35 v68.55,62.32 | v75.59,61.44 75.59,60.54 C21.2 | U1.47 73.46,43.86 v73.46,43.45
  Top 0.406: U$5.P$1 34.26,7.91 33.77,7.91 33.35,7.49 33.35,6.27 33.13,6.05 C5.2 | 32.09,5.96 C5.2 | 57.73,5.96 57.91,5.96 C6.2 | C2.2 26.03,6.02 26.03,3.38 | C1.2 29.08,5.97 29.08,3.38 | C5.2 32.13,5.92 32.13,3.38 | C6.2 58,3.41 58.03,3.38 | C3.2 61,3.46 61.08,3.38 | C4.2 64,3.55 63.83,3.38 | J1.5 44,65.38 43.71,65.09 43.1,65.09 42.55,64.55 J4.5 | R8.1 36.7,3.38 | U$4.P$1 56.39,7.91 56.82,7.49 56.82,6.43 57.19,6.05 C6.2 | R9.1 56.09,3.49 56.21,3.38 | C17.2 65.25,52.27 v64.62,52.9 | 75.69,60.72 C21.2 | v80.47,62.66 80.47,63.97 D2.C | v85.65,47.72 v85.66,47.71 J6.1 | IC3.3 48.36,16.63 v48.16,16.63
  Top 0.508: C16.2 9.97,43.05 9.27,43.76 9.27,46.81 9.88,47.41 9.96,47.5 D3.C | v52.73,52.9 50.6,52.9 v49.7,52 | v49.7,52 49.68,51.99 v49.7,52
  Top 0.61: U2.4 19.38,41.42 C12.2 19.57,41.62 v20.55,41.62 v20.55,40.41 v20.55,39.19 | C16.2 C15.2 13.84,42.89 v13.84,41.62 v13.84,40.41 v13.84,39.19 | 40.66,3.38 40.68,3.4 J2.SHLD3 J2.SHLD1 41.26,8.66 J2.GND | 49.5,3.38 49.32,3.56 J2.SHLD4 49.32,6.88 J2.SHLD2 48.74,8.66 J2.GND2 | v26.03,46.5 24.55,46.5 24.35,46.7 | 20.24,7.18 20.24,11.57 v23.47,14.8
  Top 1.27: 16.58,30.65 14.14,30.65 13,31.8 JP2.1 11.11,32.73 10.2,33.42 10,33.61 C10.2 8.22,35.05 8,35.27 C7.2 | JP1.1 17,31.07 16.58,30.65 | 16.58,30.65 20.24,26.99 20.24,7.18 20.24,4.74 21.61,3.38 C8.- 26.03,3.38 29.08,3.38 32.13,3.38 36.7,3.38 37.31,3.38 38.53,3.38 40.66,3.38 49.5,3.38 56.21,3.38 58.03,3.38 61.08,3.38 62,3.38 63.83,3.38 C9.- | 17.6,30.65 16.58,30.65 | C13.2 C12.2 22.69,41 24.35,39.35 | 16.58,30.65 20.73,30.65 J3.3 22.05,31.87 25.73,31.87 26.34,32.48 26.34,37.36 24.35,39.35 | C18.2 24.35,46.7 24.35,39.35
  Bottom 0.152: C27.2 41.31,13.28 v41.15,13.28
  Bottom 0.305: R6.1 48.95,8.61 | 48.95,8.61 49.38,8.17 | 49.38,8.17 49.38,8.09 | 49.38,8.09 49.38,8.17 | 49.38,8.17 48.95,8.61 | 48.95,8.61 R6.1 | 41.05,9.93 R7.1 41.05,13.18 v41.15,13.28 42.06,12.36 44.2,12.36 46.63,12.36 48.16,13.89 48.16,15.72 47.85,16.02 | 41.05,9.93 41.05,8.61 40.62,8.17 40.62,8.09 | R6.1 48.95,8.61 | 48.95,8.61 49.38,8.17 | 49.38,8.17 49.38,8.09 | R6.1 49.38,9.57 49.38,8.09 | J2.SHLD2 49.32,9.63 R6.1 | v76.2,55.65 76.05,55.49 | 76.05,55.49 72.54,51.99 v71.32,51.99 | C25.1 76.42,55.26 | 76.42,55.26 76.19,55.49 76.05,55.49 | C26.1 77.42,58.55 77.42,56.25 76.42,55.26 | R5.1 74.27,31.77 76.61,34.1 U$7.P$4 76.1,34.1 74.25,35.95 C24.2 74.13,36.07 v73.76,36.44 | J2.SHLD1 40.68,9.56 41.05,9.93 | 47.85,16.02 47.58,15.75 U$8.P$3 45.14,15.75 45,15.61 U$8.P$6 U$8.P$7 | U$8.P$2 47.62,16.25 | 47.85,16.02 47.62,16.25 | U$8.P$1 47.12,16.75 47.62,16.25 | U$6.P$5 68.89,62.98 68.89,62.35 | 68.89,62.35 68.89,61.14 U$6.P$2 68.91,59.88 69.49,59.3 74.98,59.3 75.59,59.91 v75.59,61.44 | v68.55,62.32 68.58,62.35 68.89,62.35 | v73.46,43.45 73.46,42.69 | 73.46,42.69 73.46,42.39 | 73.46,42.69 C22.2
  Bottom 0.406: v64.62,52.9 64.67,52.95 C19.2 | C23.2 70.36,52.95 | 70.36,52.95 v71.32,51.99 72.54,51.99 v76.2,55.65 | v85.65,47.72 84.93,47 C20.2 82.72,47.9 82.71,47.9 78.48,52.13 C25.1 76.2,55.49 v76.2,55.65 | v76.2,54.12 v76.2,55.65 | 72.85,47.41 72.85,43.76 | 72.85,43.76 72.85,43.45 | 72.85,47.41 72.85,50.46 70.36,52.95 | R5.1 70.36,31 68.28,33.09 68.28,45.89 69.8,47.41 71.93,47.41 72.85,47.41 | v48.16,16.63 48.16,15.72 | C26.1 78.48,60.67 v80.47,62.66 | 73.46,42.69 C22.2 | 72.85,43.76 72.85,43 73.46,42.39 73.42,42.35 C29.2
  Bottom 0.508: C11.2 49.05,67.84 43.41,67.84 42.55,66.99 J4.5 | C23.2 C19.2 63.45,52.95 63.4,52.9 v52.73,52.9 | v49.7,52 49.52,52 49.25,52.27 47.88,52.27 42.73,57.41 40.6,57.41 | U$6.P$2 68.91,61.44 | C27.2 41.27,13.24 C28.2
  Bottom 0.61: v13.84,41.62 v20.55,41.62 | J4.5 42.55,59.37 40.6,57.41 29.69,46.5 v26.03,46.5 | Q1.2 R11.1 25.3,17.2 25.3,15.41 24.99,15.11 23.77,15.11 v23.47,14.8
  other vias: 33.04,30.35 40.66,24.56 55.6,24.86 56.51,15.41 58.34,10.84 73.58,2.91 71.45,28.52 66.26,19.07 61.69,23.03 62.91,31.57 68.09,40.1 67.18,35.53 64.74,45.89 65.05,56.25 78.46,50.46 74.19,51.68 76.93,47.42 61.08,52.6 58.04,49.55 52.55,34 45.54,29.13 41.27,54.73 38.22,50.77 32.74,41.93 55.6,45.28 34.87,58.08 38.83,60.52 56.82,62.96 55.6,57.78 39.14,66.01 23.59,61.13 15.97,58.08 7.44,56.56 6.83,46.81 15.06,21.2 15.06,10.84 33.35,12.06 29.99,17.24 29.99,21.2 36.7,16.02 55.9,19.07 75.41,16.02 22.68,26.99 18.72,2.91 66.87,49.24 62,46.2 51.63,27.3 45.54,23.95 63.22,38.88 67.79,43.15 42.19,22.73
  pour Top: -0.91,73.32 95.1,73.32 95.1,-6.53 -0.91,-6.53
  pour Bottom: -1.52,77.59 102.11,77.59 102.11,-14.76 -1.52,-14.76
KEY_1
  Top 0.305: U1.34 68.28,47.87 62.76,47.87 51.94,58.69 37.61,58.69 33.04,63.27 19.02,63.27 18.11,62.35 15.54,62.35 | 15.54,62.35 15.36,62.35 | 15.54,62.35 14.94,62.35 14.15,61.57 S4.4
KEY_2
  Top 0.305: U1.35 68.53,47.41 62.3,47.41 51.63,58.08 37.31,58.08 32.74,62.66 22.68,62.66 21.91,61.88 S2.4
LED_1
  Top 0.305: U1.33 68.03,48.33 63.22,48.33 52.24,59.3 37.92,59.3 33.22,64 R1.2
LED_2
  Top 0.305: U1.17 74.95,58.08 75.29,58.08 76.2,59 76.5,59 76.81,59.3 76.81,61.74 76.2,62.35 73.76,62.35 73.36,62.76 R2.2
N$1
  Top 0.305: U$5.P$4 34.75,17.25 U$3.P$2
N$2
  Top 0.305: U$5.P$3 35.25,11.22 36.09,12.06 37.44,12.06 U$3.P$1
N$3
  Top 0.305: U$4.P$4 54.75,11.69 54.38,12.06 52.56,12.06 U$2.P$2
N$4
  Top 0.305: U$4.P$3 55.25,17.25 U$2.P$1
N$5
  Top 0.61: C14.2 21.56,43.05 20.61,44 U2.5 18.17,44 18.11,44.06 18.11,47.26 L1.P$1
N$6
  Top 0.61: U2.6 C14.1
N$7
  Top 0.305: R1.1 D1.A
N$8
  Top 0.305: R2.1 D2.A
N$9
  Top 0.508: D3.A 12.76,50.5 R3.1
N$10  (via drill 0.35)
  Top 0.305: J2.B5 46.75,10.85 v46.45,11.14
  Bottom 0.305: v46.45,11.14 47.05,10.55 R6.2
N$11  (via drill 0.35)
  Top 0.305: J2.A5 43.75,11.1 v43.41,11.45
  Bottom 0.305: v43.41,11.45 43.41,10.46 R7.2
N$12
  Top 0.305: U1.30 69.19,53.92 69.19,53.98 69,54.17 C17.1
N$13  (via drill 0.35)
  Top 0.305: U1.5 80.47,52.99 v80.47,51.68
  Bottom 0.305: Y1.1 78.8,54.78 C25.2 80.38,51.77 v80.47,51.68
N$14  (via drill 0.35)
  Top 0.305: U1.6 81.9,55.13 v81.99,55.03
  Bottom 0.305: C26.2 80.38,57.6 Y1.3 81.99,55.99 v81.99,55.03
N$15
  Top 0.305: U$5.P$9 36.7,5.96 R8.2
N$16
  Top 0.305: U$4.P$9 55.75,5.54 R9.2
N$17
  Top 0.406: D4.A 38.83,9.01 38.83,9.62 39.44,10.23 42.19,10.23 42.55,9.87 J2.VBUS1 42.55,7.43 43.1,6.88 47.06,6.88 47.45,7.26 J2.VBUS2
N$18
  Bottom 0.61: Q1.3 23.01,21.08 R10.1 22.86,24.25 27.74,29.13 27.74,34.31 24.99,37.05 22.05,37.05 J3.1
N$19
  Top 0.305: R12.1 64.96,64.79 69.19,64.79 70.1,63.87 70.1,63.51 U$9.P$2
PWM_LEFT_A  (via drill 0.35)
  Top 0.305: U$5.P$7 34.75,5.78 v35.17,5.35 | U1.37 48.3,25.77 v47.24,25.77
  Bottom 0.305: v35.17,5.35 35.17,6.14 34.75,6.57 32.92,6.57 32.31,7.18 32.31,17.85 40.23,25.77 v47.24,25.77
PWM_LEFT_B  (via drill 0.35)
  Top 0.305: U1.38 51.48,28.25 50.29,27.06 v50.29,26.69 | U$5.P$6 34.25,5.95 v33.65,5.35
  Bottom 0.305: v33.65,5.35 33.35,5.66 32.61,5.66 31.7,6.57 31.7,18.15 40.23,26.69 47.55,26.69 | 47.55,26.69 47.85,26.69 | 47.55,26.69 v50.29,26.69
PWM_RIGHT_A  (via drill 0.35)
  Top 0.305: U$4.P$7 54.75,5.42 54.38,5.05 52.85,5.05 51.94,5.96 v51.94,8.71 | U1.58 82.3,45.77 82.3,44.67 77.72,40.1 73.42,40.1 70.87,37.55 70.87,37.51 70.71,37.36 70.71,33.09 67.67,30.04 v66.45,30.04
  Bottom 0.305: v51.94,8.71 64.74,21.51 64.74,28.82 65.35,29.43 65.84,29.43 v66.45,30.04
PWM_RIGHT_B  (via drill 0.35)
  Top 0.305: U$4.P$6 54.25,5.83 54.07,5.66 53.46,5.66 52.85,6.27 v52.85,8.1 | U1.59 82.91,45.86 82.91,44.56 77.91,39.56 74.14,39.56 73.76,39.19 73.15,39.19 71.32,37.36 71.32,36.75 | 71.32,36.75 71.32,35.83 | 71.32,36.75 71.32,32.78 v67.67,29.13
  Bottom 0.305: 65.66,27.3 65.66,20.9 v52.85,8.1 | 65.66,27.3 65.66,27.6 | 65.66,27.3 65.66,28.52 66.27,29.13 v67.67,29.13
RESET  (via drill 0.35)
  Top 0.305: U1.7 77.13,51.07 | 77.13,51.07 77.11,51.07 | 77.13,51.07 77.13,49.84 v78.64,48.33 | v80.16,34.92 80.16,33.39 79.55,32.78 73.1,32.78 S3.4 72.54,32.84 v72.54,32.17
  Bottom 0.305: U$7.P$6 79.71,35.37 v80.16,34.92 80.47,35.22 80.47,43.45 78.64,45.28 v78.64,48.33 | C24.1 R4.1 72.54,33.03 v72.54,32.17
RX  (via drill 0.35)
  Top 0.305: U1.43 71.44,44.67 70.41,44.67 v69.49,43.76 | U$7.P$3 76.05,35.37 74.07,37.36 v74.07,38.27
  Bottom 0.305: v69.49,43.76 69.49,40.71 71.93,38.27 v74.07,38.27
S_RESET  (via drill 0.35)
  Top 0.305: J1.4 44.5,64.67 J4.4 43.83,62.54 45.23,61.13 v52.85,61.13 | U1.27 63.8,61.44 56.21,61.44 53.77,63.87 v52.85,63.87
  Bottom 0.305: v52.85,63.87 v52.85,61.13
SCL
  Top 0.305: J1.2 45.5,64.87 J4.2 46.37,63.35 46.76,62.96 53.77,62.96 55.9,60.83 63.7,60.83 U1.28
SCLG  (via drill 0.35)
  Top 0.305: U1.52 78.96,44.86 78.96,44.45 77.04,42.54 72.54,42.54 68.43,38.42 65.99,38.42 52.73,25.16 v52.73,23.64
  Bottom 0.305: U$8.P$13 45,19.37 | 45,19.37 45,20.48 47.55,23.03 51.21,23.03 52.12,23.03 v52.73,23.64 | R15.2 45,19.37
SCLM  (via drill 0.35)
  Top 0.305: U1.20 70.71,59.47 v70.71,60.83
  Bottom 0.305: U$6.P$1 70.1,60.83 v70.71,60.83 71.36,60.83 R13.1
SDA
  Top 0.305: J1.3 45,64.09 | 45,64.09 J4.3 | U1.29 63.6,60.22 55.6,60.22 53.46,62.35 45.54,62.35 45,62.89 45,64.09
SDAG  (via drill 0.35)
  Top 0.305: U1.53 79.53,44.99 79.53,44.39 77.08,41.93 72.85,41.93 68.89,37.97 66.45,37.97 65.23,36.75 65.23,36.44 54.25,25.47 v54.25,23.64
  Bottom 0.305: U$8.P$14 45.5,19.76 48.16,22.42 49.99,22.42 | v54.25,23.64 53.03,22.42 49.99,22.42 | R16.2 49.68,22.12 49.99,22.42
SDAM  (via drill 0.35)
  Top 0.305: U1.21 69.56,59.91 67.67,59.91 v67.36,60.22
  Bottom 0.305: R14.1 67.36,60.79 | 67.36,60.79 67.7,60.79 U$6.P$3 | v67.36,60.22 67.36,60.79
SL0  (via drill 0.35)
  Top 0.305: J5.2 7.15,52.46 v7.62,51.99 | v35.36,56.56 51.82,56.56 v52.43,55.95 | v69,58.27 68.89,58.15 68.89,57.76 U1.25
  Bottom 0.305: v7.62,51.99 15.54,51.99 16.46,52.9 32.61,52.9 35.36,55.65 v35.36,56.56 | v52.43,55.95 52.43,56.56 55.78,59.91 62.48,59.91 64.92,57.47 68.21,57.47 v69,58.27
SL1  (via drill 0.35)
  Top 0.305: J5.3 7.08,49.92 v7.32,50.16 | v36.27,55.03 36.88,55.65 49.38,55.65 50.9,55.65 v51.51,55.03 | v67.97,58.39 67.97,57.97 U1.26
  Bottom 0.305: v7.32,50.16 7.92,50.77 16.46,50.77 17.68,51.99 33.22,51.99 v36.27,55.03 | v67.97,58.39 64.92,58.39 64.47,58.84 62.79,60.52 54.86,60.52 51.51,57.17 v51.51,55.03
SPEAKER
  Top 0.305: U1.22 71.16,57.61 | 71.09,57.68 71.16,57.61 | 71.16,57.61 71.16,57.64 69.49,59.3 66.75,59.3 63.7,62.35 63.09,62.35 62.45,63 R12.2
SR0
  Top 0.305: U1.8 81.07,55.72 82.27,55.72 83.21,54.78 83.21,53.51 84.12,52.6 84.12,50.46 85.05,49.54 J6.2
SR1
  Top 0.305: U1.9 79.95,55.24 81.03,56.33 82.42,56.33 84.12,54.62 84.12,53.51 85.56,52.08 J6.3
SWCLK  (via drill 0.35)
  Top 0.305: U1.49 76.66,45.04 v76.66,45.74
  Bottom 0.305: v76.66,45.74 76.81,45.89 79.86,42.84 79.86,37.05 79.45,36.64 U$7.P$7
SWDIO  (via drill 0.35)
  Top 0.305: U1.46 74.68,45.79 v74.68,46.81
  Bottom 0.305: v74.68,46.81 75.59,45.89 75.59,45.59 78.94,42.23 78.94,38.27 78.59,37.91 U$7.P$8
TX  (via drill 0.35)
  Top 0.305: U1.42 71.95,45.89 70.23,45.89 69.49,45.16 v69.49,44.98 | U$7.P$2 76.3,36.64 75.29,37.66 v75.29,38.27
  Bottom 0.305: v75.29,38.27 74.3,39.26 72.16,39.26 70.41,41.01 70.41,44.37 69.8,44.98 v69.49,44.98
VCC  (via drill 0.35)
  Top 0.305: U$5.P$2 36.19,8.91 v36.7,8.4 | U$4.P$2 55.75,9.16 55.9,9.32 57.2,9.32 57.51,9.01
  Top 0.406: C5.1 32.59,7.95 v33.35,8.71 | C6.1 57.51,8.44 57.51,9.01 | D4.C 38.83,5.05 v38.53,4.74
  Top 0.61: U2.2 15.61,44 15.36,43.76 15.36,42.84 | 15.36,42.84 15.36,41.32 15.68,41 C12.1 | U2.3 15.57,43.05 15.36,42.84
  Top 1.016: v66.87,8.4 67,8.28 C9.+ | v62.3,8.71 62.3,7.95
  Top 1.27: C5.1 C1.1 27.55,7.95 | 27.55,7.95 C2.1 24.32,7.95 | C8.+ 24.32,7.95 | C6.1 C3.1 62.3,7.95 C4.1 65.67,7.95 C9.+ 67.36,6.27 | JP2.2 15.36,35.27 | 15.36,35.27 JP1.2 | 15.36,35.27 15.36,36.31 C13.1 C12.1 | 24.32,7.95 24.51,8.13 v24.51,9.01 | v27.55,9.01 27.55,7.95 | C7.1 9.59,37.95 10,37.54 C10.1 13.68,36.95 15.36,35.27
  Bottom 0.406: v33.35,8.71 36.39,8.71 v36.7,8.4
  Bottom 0.61: R10.2 20.28,19.03 20.24,19.07
  Bottom 1.016: 23.9,5.96 26.34,3.52 38.22,3.52 38.53,3.83 v38.53,4.74 39.75,5.96 41.09,5.96 41.34,5.71 50.37,5.71 52.55,3.52 62.3,3.52 | 62.3,3.52 63.83,3.52 64.74,4.44 66.87,6.57 v66.87,8.4 | 62.3,3.52 v62.3,8.71
  Bottom 1.27: 24.51,5.96 23.9,5.96 20.24,9.62 20.24,19.07 20.24,24.55 20.24,27.26 21.8,28.82 24.51,28.82 25.73,30.04 25.73,33.39 24.66,34.46 J3.2 19.78,34.46 18.97,35.27 JP1.2 JP2.2 | 24.51,5.96 27.25,5.96 27.25,8.71 v27.55,9.01 | 24.51,5.96 v24.51,9.01

### Text on the board
tNames: BAT+ | GND